# EAGLE design MD_20w (EAGLE 7.2.0)
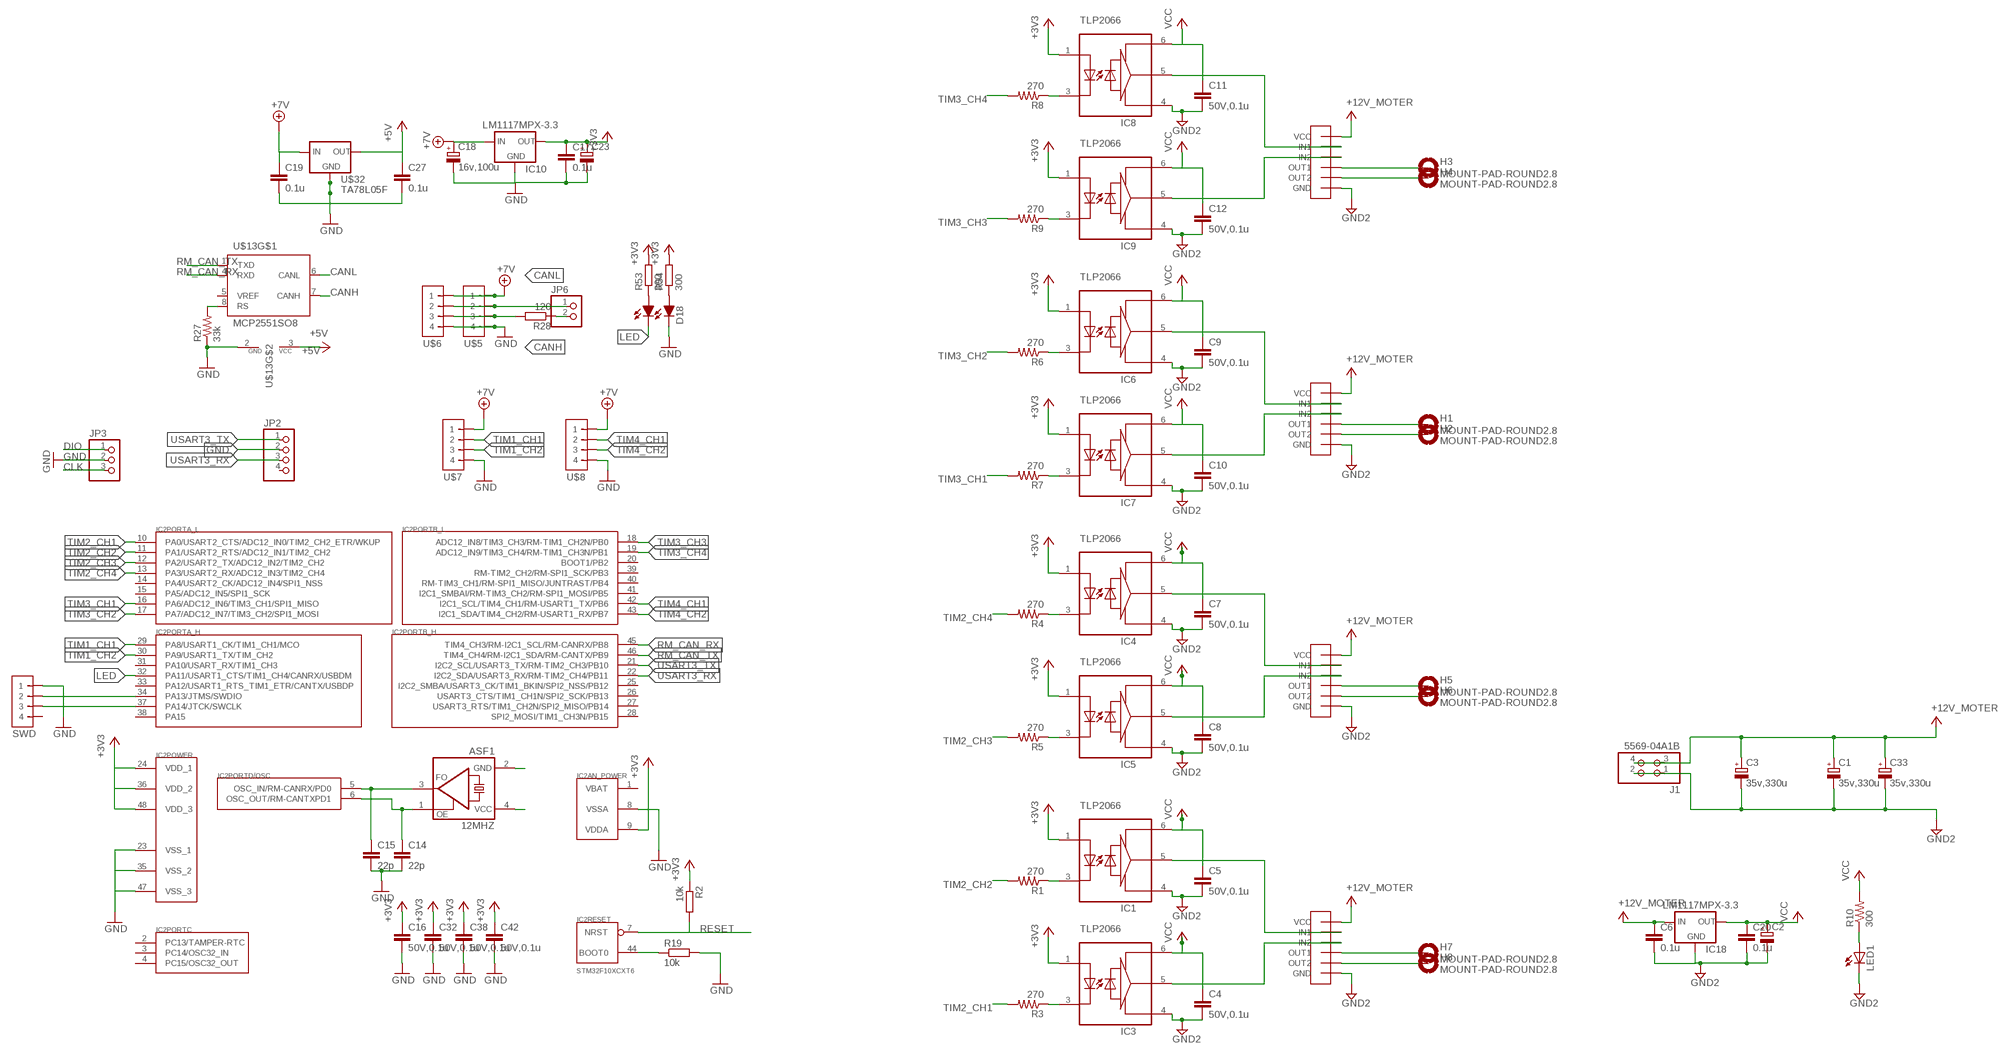
[diagram p0: schematic, sheet 1]

## Parts
12MHZ  ASF1  [ASF]
C1  35v,330u  CPOL-EU153CLV-1010  [153CLV-1010]
C2  CPOL-EU153CLV-0505  [153CLV-0505]
C3  35v,330u  CPOL-EU153CLV-1010  [153CLV-1010]
C4  50V,0.1u  C-EUC0603  [C0603]
C5  50V,0.1u  C-EUC0603  [C0603]
C6  0.1u  C-EUC0603  [C0603]
C7  50V,0.1u  C-EUC0603  [C0603]
C8  50V,0.1u  C-EUC0603  [C0603]
C9  50V,0.1u  C-EUC0603  [C0603]
C10  50V,0.1u  C-EUC0603  [C0603]
C11  50V,0.1u  C-EUC0603  [C0603]
C12  50V,0.1u  C-EUC0603  [C0603]
C14  22p  C-EUC0603  [C0603]
C15  22p  C-EUC0603  [C0603]
C16  50V,0.1u  C-EUC0603K  [C0603K]
C17  0.1u  C-EUC0603K  [C0603K]
C18  16v,100u  CPOL-EU153CLV-0605  [153CLV-0605]
C19  0.1u  C-EUC0603  [C0603]
C20  0.1u  C-EUC0603K  [C0603K]
C23  CPOL-EU153CLV-0505  [153CLV-0505]
C27  0.1u  C-EUC0603  [C0603]
C32  50V,0.1u  C-EUC0603K  [C0603K]
C33  35v,330u  CPOL-EU153CLV-1010  [153CLV-1010]
C38  50V,0.1u  C-EUC0603K  [C0603K]
C42  50V,0.1u  C-EUC0603K  [C0603K]
D18  SEC2XX4  [LED3025]
H1  MOUNT-PAD-ROUND2.8  [2,8-PAD]
H2  MOUNT-PAD-ROUND2.8  [2,8-PAD]
H3  MOUNT-PAD-ROUND2.8  [2,8-PAD]
H4  MOUNT-PAD-ROUND2.8  [2,8-PAD]
H5  MOUNT-PAD-ROUND2.8  [2,8-PAD]
H6  MOUNT-PAD-ROUND2.8  [2,8-PAD]
H7  MOUNT-PAD-ROUND2.8  [2,8-PAD]
H8  MOUNT-PAD-ROUND2.8  [2,8-PAD]
IC1  TLP2066  TLP117  [MFSOP6]
IC2  STM32F10XCXT6  [TQFP48]
IC3  TLP2066  TLP117  [MFSOP6]
IC4  TLP2066  TLP117  [MFSOP6]
IC5  TLP2066  TLP117  [MFSOP6]
IC6  TLP2066  TLP117  [MFSOP6]
IC7  TLP2066  TLP117  [MFSOP6]
IC8  TLP2066  TLP117  [MFSOP6]
IC9  TLP2066  TLP117  [MFSOP6]
IC10  LM1117MPX-3.3  LM1117  [SOT223]
IC18  LM1117MPX-3.3  LM1117  [SOT223]
J1  5569-04A1B  [5569-04A1_2]
JP2  PINHD-1X4  [1X04]
JP3  PINHD-1X3/90  [1X03/90]
JP6  PINHD-1X2  [1X02]
LED1  LEDCHIPLED_1206  [CHIPLED_1206]
R1  270  R-US_R0603  [R0603]
R2  10k  R-EU_R0603  [R0603]
R3  270  R-US_R0603  [R0603]
R4  270  R-US_R0603  [R0603]
R5  270  R-US_R0603  [R0603]
R6  270  R-US_R0603  [R0603]
R7  270  R-US_R0603  [R0603]
R8  270  R-US_R0603  [R0603]
R9  270  R-US_R0603  [R0603]
R10  300  R-US_M2012  [M2012]
R19  10k  R-EU_R0603  [R0603]
R27  33k  R-US_R0603  [R0603]
R28  120  R-EU_R0603  [R0603]
R53  300  R-EU_R0603  [R0603]
R54  300  R-EU_R0603  [R0603]
SWD  TOP_TYPE_4PIN  [TOP_TYPE_4PIN]
U$1  TB6643  [TB6643]
U$2  TB6643  [TB6643]
U$3  TB6643  [TB6643]
U$4  TB6643  [TB6643]
U$5  S4B-XH-SM4-TB  [S4B-XH-SM4-TB]
U$6  S4B-XH-SM4-TB  [S4B-XH-SM4-TB]
U$7  S4B-XH-SM4-TB  [S4B-XH-SM4-TB]
U$8  S4B-XH-SM4-TB  [S4B-XH-SM4-TB]
U$13  MCP2551SO8  [SO08]
U$32  TA78L05F  [SOT89]

## Nets
+3V3: C16.1 C17.1 C23.+ C32.1 C38.1 C42.1 IC1.1 IC2.9(AN_POWER:VDDA) IC2.24(POWER:VDD_1) IC2.36(POWER:VDD_2) IC2.48(POWER:VDD_3) IC3.1 IC4.1 IC5.1 IC6.1 IC7.1 IC8.1 IC9.1 IC10.2(OUT1) IC10.4(OUT) R2.1 R53.2 R54.2
+5V: C27.1 U$13.3(VCC) U$32.1(OUT)
+7V: C18.+ C19.1 IC10.3(IN) U$5.1 U$6.1 U$7.1 U$8.1 U$32.3(IN)
CANH: R28.2 U$5.3 U$6.3 U$13.7(CANH)
CANL: JP6.1 U$5.2 U$6.2 U$13.6(CANL)
CLK: IC2.37(PORTA_H:PA14/JTCK/SWCLK) JP3.3 SWD.3
DIO: IC2.34(PORTA_H:PA13/JTMS/SWDIO) JP3.1 SWD.2
GND: C14.2 C15.2 C16.2 C17.2 C18.- C19.2 C23.- C27.2 C32.2 C38.2 C42.2 D18.1(C0) IC2.8(AN_POWER:VSSA) IC2.23(POWER:VSS_1) IC2.35(POWER:VSS_2) IC2.47(POWER:VSS_3) IC10.1(GND) JP2.2 JP3.2 R19.2 R27.1 SWD.1 U$5.4 U$6.4 U$7.4 U$8.4 U$13.2(GND) U$32.2(GND) U$32.2@1(GND1)
GND2: C1.- C2.- C3.- C4.2 C5.2 C6.2 C7.2 C8.2 C9.2 C10.2 C11.2 C12.2 C20.2 C33.- IC1.4(GND) IC3.4(GND) IC4.4(GND) IC5.4(GND) IC6.4(GND) IC7.4(GND) IC8.4(GND) IC9.4(GND) IC18.1(GND) J1.1 J1.2 LED1.C U$1.GND U$2.GND U$3.GND U$4.GND
LED: D18.2(C1) IC2.32(PORTA_H:PA11/USART1_CTS/TIM1_CH4/CANRX/USBDM)
N$1: IC1.3 R1.1
N$2: IC3.3 R3.1
N$3: IC1.5 U$1.IN1
N$4: IC3.5 U$1.IN2
N$5: IC4.5 U$2.IN1
N$6: IC5.5 U$2.IN2
N$7: IC4.3 R4.1
N$8: IC5.3 R5.1
N$9: IC2.44(RESET:BOOT0) R19.1
N$10 [VCC]: 12MHZ.2(GND)
N$11: 12MHZ.3(FO) C15.1 IC2.5(PORTD/OSC:OSC_IN/RM-CANRX/PD0)
N$12: 12MHZ.1(OE) C14.1 IC2.6(PORTD/OSC:OSC_OUT/RM-CANTXPD1)
N$13: H5.B2,8(MOUNT) U$2.OUT1
N$14: H6.B2,8(MOUNT) U$2.OUT2
N$15: H7.B2,8(MOUNT) U$1.OUT1
N$16: IC6.3 R6.1
N$17: H8.B2,8(MOUNT) U$1.OUT2
N$18: IC7.3 R7.1
N$19: IC6.5 U$3.IN1
N$20: IC7.5 U$3.IN2
N$21: H1.B2,8(MOUNT) U$3.OUT1
N$22: H2.B2,8(MOUNT) U$3.OUT2
N$23: IC8.3 R8.1
N$24: IC9.3 R9.1
N$25: IC8.5 U$4.IN1
N$26: IC9.5 U$4.IN2
N$27: H3.B2,8(MOUNT) U$4.OUT1
N$28: H4.B2,8(MOUNT) U$4.OUT2
N$33: LED1.A R10.1
N$34: R27.2 U$13.8(RS)
N$35: JP6.2 R28.1
N$36: 12MHZ.4(VCC)
N$43: D18.3(A1) R53.1
N$58: D18.4(A0) R54.1
RESET: IC2.7(RESET:NRST) R2.2
RM_CAN_RX: IC2.45(PORTB_H:TIM4_CH3/RM-I2C1_SCL/RM-CANRX/PB8) U$13.4(RXD)
RM_CAN_TX: IC2.46(PORTB_H:TIM4_CH4/RM-I2C1_SDA/RM-CANTX/PB9) U$13.1(TXD)
TIM1_CH1: IC2.29(PORTA_H:PA8/USART1_CK/TIM1_CH1/MCO) U$7.2
TIM1_CH2: IC2.30(PORTA_H:PA9/USART1_TX/TIM_CH2) U$7.3
TIM2_CH1: IC2.10(PORTA_L:PA0/USART2_CTS/ADC12_IN0/TIM2_CH2_ETR/WKUP) R3.2
TIM2_CH2: IC2.11(PORTA_L:PA1/USART2_RTS/ADC12_IN1/TIM2_CH2) R1.2
TIM2_CH3: IC2.12(PORTA_L:PA2/USART2_TX/ADC12_IN2/TIM2_CH2) R5.2
TIM2_CH4: IC2.13(PORTA_L:PA3/USART2_RX/ADC12_IN3/TIM2_CH4) R4.2
TIM3_CH1: IC2.16(PORTA_L:PA6/ADC12_IN6/TIM3_CH1/SPI1_MISO) R7.2
TIM3_CH2: IC2.17(PORTA_L:PA7/ADC12_IN7/TIM3_CH2/SPI1_MOSI) R6.2
TIM3_CH3: IC2.18(PORTB_L:ADC12_IN8/TIM3_CH3/RM-TIM1_CH2N/PB0) R9.2
TIM3_CH4: IC2.19(PORTB_L:ADC12_IN9/TIM3_CH4/RM-TIM1_CH3N/PB1) R8.2
TIM4_CH1: IC2.42(PORTB_L:I2C1_SCL/TIM4_CH1/RM-USART1_TX/PB6) U$8.2
TIM4_CH2: IC2.43(PORTB_L:I2C1_SDA/TIM4_CH2/RM-USART1_RX/PB7) U$8.3
USART3_RX: IC2.22(PORTB_H:I2C2_SDA/USART3_RX/RM-TIM2_CH4/PB11) JP2.3
USART3_TX: IC2.21(PORTB_H:I2C2_SCL/USART3_TX/RM-TIM2_CH3/PB10) JP2.1
V+: C1.+ C3.+ C6.1 C33.+ IC18.3(IN) J1.3 J1.4 U$1.VCC U$2.VCC U$3.VCC U$4.VCC ; supply symbol labelled +12V_MOTER
VCC: C2.+ C4.1 C5.1 C7.1 C8.1 C9.1 C10.1 C11.1 C12.1 C20.1 IC1.6(VCC) IC3.6(VCC) IC4.6(VCC) IC5.6(VCC) IC6.6(VCC) IC7.6(VCC) IC8.6(VCC) IC9.6(VCC) IC18.2(OUT1) IC18.4(OUT) R10.2
Unconnected: IC2.2(PORTC:PC13/TAMPER-RTC) IC2.3(PORTC:PC14/OSC32_IN) IC2.4(PORTC:PC15/OSC32_OUT) IC2.14(PORTA_L:PA4/USART2_CK/ADC12_IN4/SPI1_NSS) IC2.15(PORTA_L:PA5/ADC12_IN5/SPI1_SCK) IC2.20(PORTB_L:BOOT1/PB2) IC2.25(PORTB_H:I2C2_SMBA/USART3_CK/TIM1_BKIN/SPI2_NSS/PB12) IC2.26(PORTB_H:USART3_CTS/TIM1_CH1N/SPI2_SCK/PB13) IC2.27(PORTB_H:USART3_RTS/TIM1_CH2N/SPI2_MISO/PB14) IC2.28(PORTB_H:SPI2_MOSI/TIM1_CH3N/PB15) IC2.31(PORTA_H:PA10/USART_RX/TIM1_CH3) IC2.33(PORTA_H:PA12/USART1_RTS_TIM1_ETR/CANTX/USBDP) IC2.38(PORTA_H:PA15) IC2.39(PORTB_L:RM-TIM2_CH2/RM-SPI1_SCK/PB3) IC2.40(PORTB_L:RM-TIM3_CH1/RM-SPI1_MISO/JUNTRAST/PB4) IC2.41(PORTB_L:I2C1_SMBAI/RM-TIM3_CH2/RM-SPI1_MOSI/PB5) JP2.4 SWD.4 U$13.5(VREF)

## Notes on the sheet
- TLP2066
- TLP2066
- TLP2066
- TLP2066
- TLP2066
- TLP2066
- TLP2066
- TLP2066

## Power pins joined to a net without a drawn wire
VBAT: IC2.1(AN_POWER:VBAT)

## Library data of the parts
12MHZ = crystal:ASF*: CRYSTAL CLOCK OSCILLATORS 5.0 Vdc or 3.3 Vdc - LOW PROFILE ULTRA MINIATURE CERAMIC SURFACE MOUNT Source: http://www.abracon.com/Oscillators/asf1-L-L1.pdf
C1-C3 C18 C23 C33 = rcl:CPOL-EU: POLARIZED CAPACITOR, European symbol
C4-C12 C14 C15 C19 C27 = rcl:C-EU: CAPACITOR, European symbol
C16 C17 C20 C32 C38 C42 = resistor:C-EU: CAPACITOR, European symbol
D18 = SRT162-010:SEC2XX4
H1-H8 = holes:MOUNT-PAD-ROUND: MOUNTING PAD, round
IC1 IC3-IC9 = PhotoCoupler:TLP117
IC2 = stm32:STM32F10XCXT6: ST STM32F101/103 48pin LQFP
IC10 IC18 = VoltageRegulator:LM1117
J1 = Molex:5569-04A1
JP2 = pinhead:PINHD-1X4: PIN HEADER
JP3 = pinhead:PINHD-1X3: PIN HEADER
JP6 = pinhead:PINHD-1X2: PIN HEADER
LED1 = led:LED: LED OSRAM: - CHIPLED LG R971, LG N971, LY N971, LG Q971, LY Q971, LO R971, LY R971 LH N974, LH R974 LS Q976, LO Q976, LY Q976 LO Q996 - Hyper CHIPLED LW Q18S LB Q993, LB Q99A, LB R99A - SideLED LS A670, LO A670, LY A670, LG A670, LP A670 LB A673, LV A673, LT A673, LW A673 LH A674 LY A675 LS A676, LA A676, LO A676, LY A676, LW A676 LS A679, LY A679, LG A679 - Hyper Micro SIDELED® LS Y876, LA Y876, LO Y876, LY Y876 LT Y87S - SmartLED LW L88C, LW L88S LB L89C, LB L89S, LG L890 LS L89K, LO L89K, LY L89K LS L896, LA L896, LO L896, LY L896 - TOPLED LS T670, LO T670, LY T670, LG T670, LP T670 LSG T670, LSP T670, LSY T670, LOP T670, LYG T670 LG T671, LOG T671, LSG T671 LB T673, LV T673, LT T673, LW T673 LH T674 LS T676, LA T676, LO T676, LY T676, LB T676, LH T676, LSB T676, LW T676 LB T67C, LV T67C, LT T67C, LS T67K, LO T67K, LY T67K, LW E67C LS E67B, LA E67B, LO E67B, LY E67B, LB E67C, LV E67C, LT E67C LW T67C LS T679, LY T679, LG T679 LS T770, LO T770, LY T770, LG T770, LP T770 LB T773, LV T773, LT T773, LW T773 LH T774 LS E675, LA E675, LY E675, LS T675 LS T776, LA T776, LO T776, LY T776, LB T776 LHGB T686 LT T68C, LB T68C - Hyper Mini TOPLED® LB M676 - Mini TOPLED Santana® LG M470 LS M47K, LO M47K, LY M47K Source: http://www.osram.convergy.de LUXEON: - LUMILED® LXK2-PW12-R00, LXK2-PW12-S00, LXK2-PW14-U00, LXK2-PW14-V00 LXK2-PM12-R00, LXK2-PM12-S00, LXK2-PM14-U00 LXK2-PE12-Q00, LXK2-PE12-R00, LXK2-PE12-S00, LXK2-PE14-T00, LXK2-PE14-U00 LXK2-PB12-K00, LXK2-PB12-L00, LXK2-PB12-M00, LXK2-PB14-N00, LXK2-PB14-P00, LXK2-PB14-Q00 LXK2-PR12-L00, LXK2-PR12-M00, LXK2-PR14-Q00, LXK2-PR14-R00 LXK2-PD12-Q00, LXK2-PD12-R00, LXK2-PD12-S00 LXK2-PH12-R00, LXK2-PH12-S00 LXK2-PL12-P00, LXK2-PL12-Q00, LXK2-PL12-R00 Source: www.luxeon.com KINGBRIGHT: KA-3528ASYC Source: www.kingbright.com
R1 R3-R9 R27 = resistor:R-US_: RESISTOR, American symbol
R2 R19 = rcl:R-EU_: RESISTOR, European symbol
R10 = rcl:R-US_: RESISTOR, American symbol
R28 R53 R54 = resistor:R-EU_: RESISTOR, European symbol
SWD = GHconnector:TOP_TYPE_4PIN
U$1-U$4 = tb6643:TB6643
U$5-U$8 = S4B-XH-SM4-TB:S4B-XH-SM4-TB
U$13 = can:MCP2551: CAN Tranceiver Microchip
U$32 = v-reg:TA78L05F

## Board
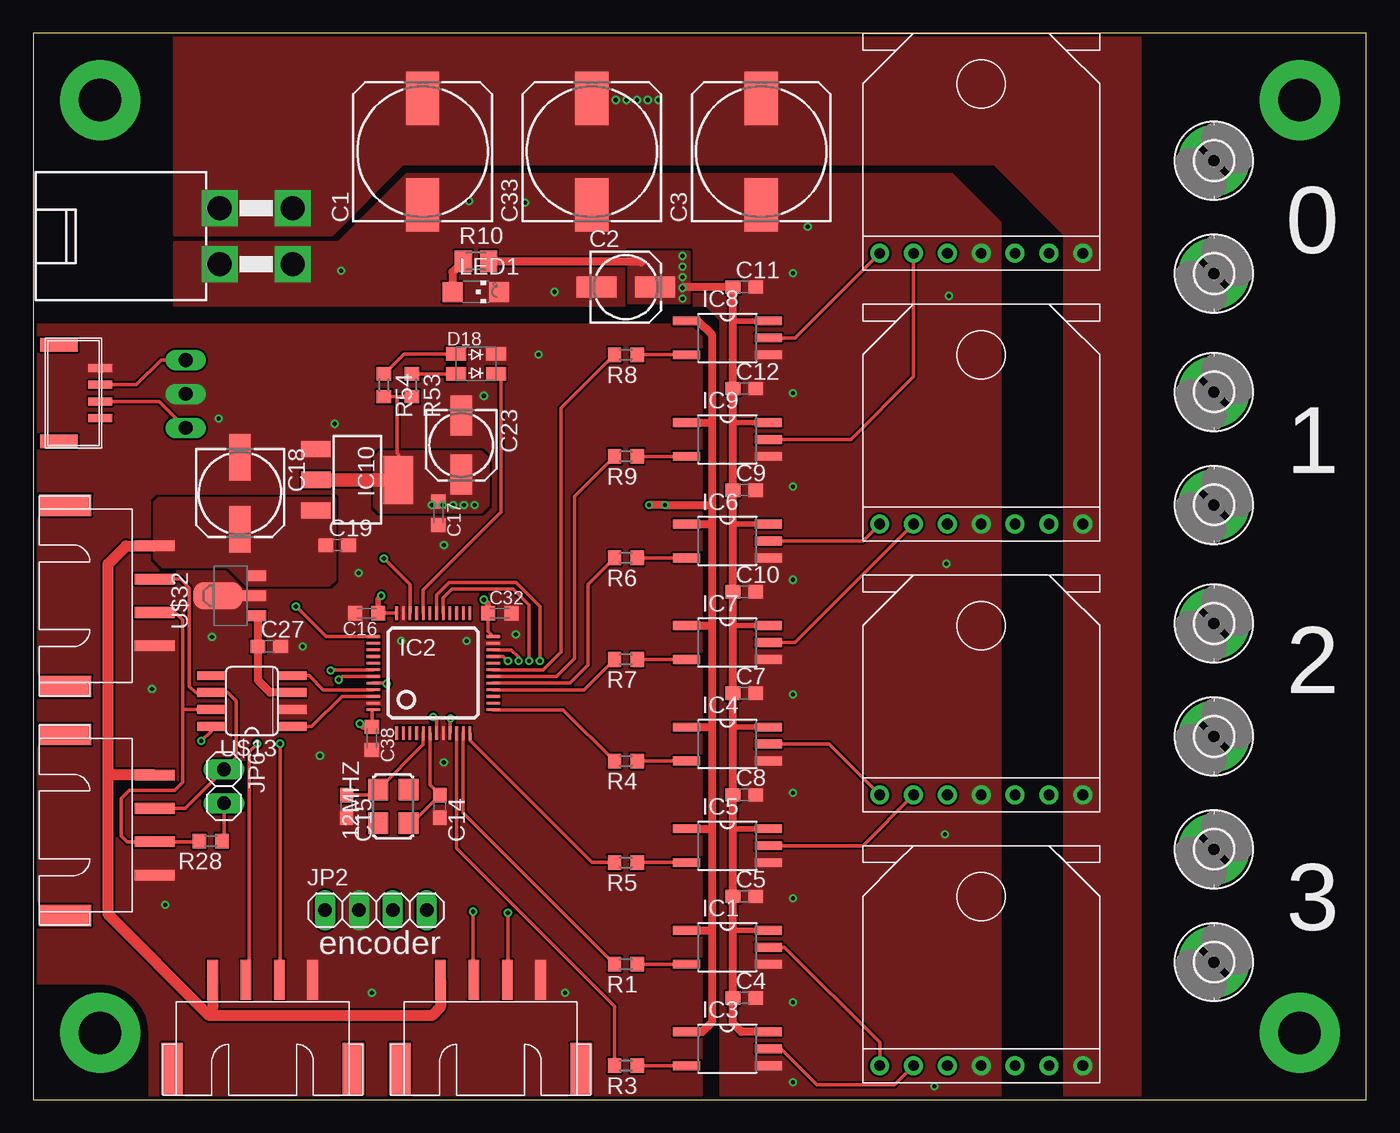
[diagram p1: board, top side]
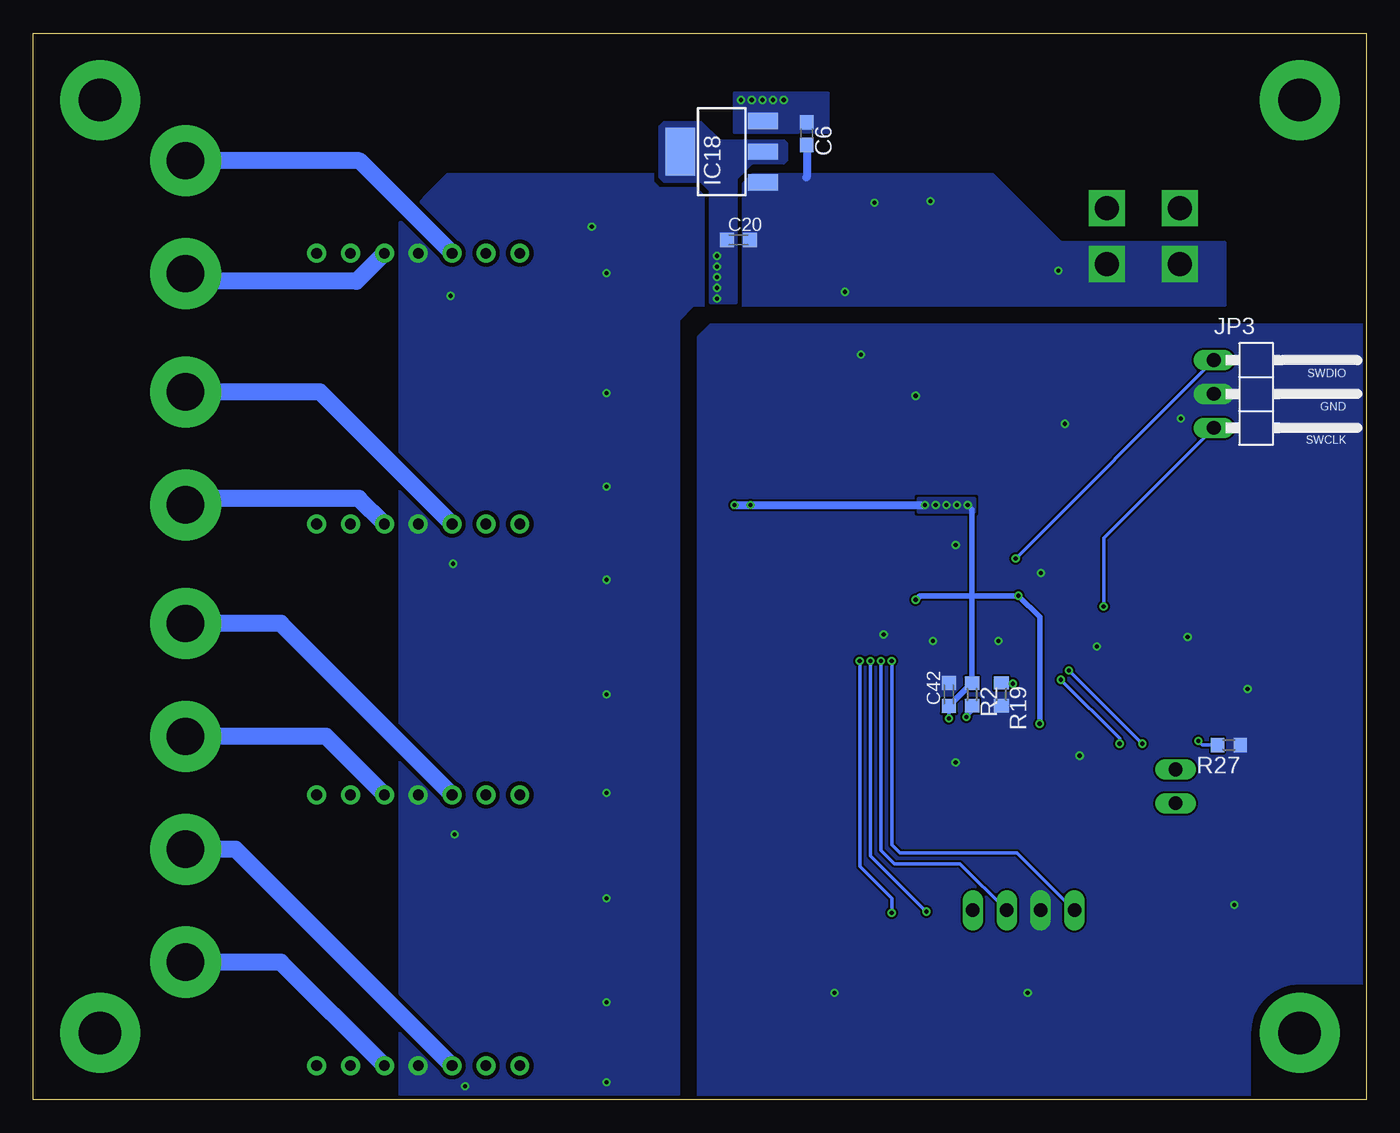
[diagram p2: board, bottom side, seen from below]

Size 100 x 80 mm. Coordinates in mm from the lower left corner, seen from the top.
Outline: 0,0 100,0 100,80 0,80 0,0
Copper layers (1*16): Top 0.035mm / dielectric 1.5mm / Bottom 0.035mm
Design rules "default *": minimum track width 6mil, minimum drill 12mil, track to track 6mil, track to pad 6mil, pad to pad 6mil, via to via 6mil, smd to smd 0mil, copper to edge 10mil, drill to drill 10mil, minimum pad ring 10mil, minimum via ring 6mil, stop-mask expansion 2mil, vias tented up to drill 100mil, thermal gap 10mil
tRestrict: 12 lines
bRestrict: 12 lines

### Footprints (pad centres in the part's own frame; a part is rotated, then mirrored left to right if it is on the bottom)
ASF = smd 1.6 x 1.5: 1 -1.25,-1.15; 2 1.25,-1.15; 3 1.25,1.15; 4 -1.25,1.15
153CLV-1010 = smd 4 x 2.5: + 4,0; - -4,0
153CLV-0505 = smd 3 x 1.6: + 2.2,0; - -2.2,0
C0603 = smd 1.1 x 1: 1 -0.85,0; 2 0.85,0
C0603K = smd 1.05 x 1.08: 1 -0.875,0; 2 0.875,0
153CLV-0605 = smd 3.5 x 1.6: + 2.7,0; - -2.7,0
LED3025 = smd 1.5 x 1: 1 1.5,0.75; 2 1.5,-0.75; 3 -1.5,-0.75; 4 -1.5,0.75
2,8-PAD = drill 2.8 pad 5.334: B2,8 0,0
MFSOP6 = smd 0.66 x 2.032: 1 -1.27,-3.073; 3 1.27,-3.073; 4 1.27,3.073; 5 0,3.073; 6 -1.27,3.073
TQFP48 = smd 0.2 x 1: 1 -2.75,-4.5; 2 -2.25,-4.5; 3 -1.75,-4.5; 4 -1.25,-4.5; 5 -0.75,-4.5; 6 -0.25,-4.5; 7 0.25,-4.5; 8 0.75,-4.5; 9 1.25,-4.5; 10 1.75,-4.5; 11 2.25,-4.5; 12 2.75,-4.5; 25 2.75,4.5; 26 2.25,4.5; 27 1.75,4.5; 28 1.25,4.5; 29 0.75,4.5; 30 0.25,4.5; 31 -0.25,4.5; 32 -0.75,4.5; 33 -1.25,4.5; 34 -1.75,4.5; 35 -2.25,4.5; 36 -2.75,4.5 | smd 1 x 0.2: 13 4.5,-2.75; 14 4.5,-2.25; 15 4.5,-1.75; 16 4.5,-1.25; 17 4.5,-0.75; 18 4.5,-0.25; 19 4.5,0.25; 20 4.5,0.75; 21 4.5,1.25; 22 4.5,1.75; 23 4.5,2.25; 24 4.5,2.75; 37 -4.5,2.75; 38 -4.5,2.25; 39 -4.5,1.75; 40 -4.5,1.25; 41 -4.5,0.75; 42 -4.5,0.25; 43 -4.5,-0.25; 44 -4.5,-0.75; 45 -4.5,-1.25; 46 -4.5,-1.75; 47 -4.5,-2.25; 48 -4.5,-2.75
SOT223 = smd 1.219 x 2.235: 1 -2.311,-3.099; 2 0,-3.099; 3 2.311,-3.099 | smd 3.6 x 2.2: 4 0,3.099
5569-04A1_2 = drill 1.8 square: 1 2.1,0; 2 2.1,5.5; 3 -2.1,0; 4 -2.1,5.5
1X04 = drill 1.016 long: 1 -3.81,0; 2 -1.27,0; 3 1.27,0; 4 3.81,0
1X03/90 = drill 1.016 long: 1 -2.54,-3.81; 2 0,-3.81; 3 2.54,-3.81
1X02 = drill 1.016 long: 1 -1.27,0; 2 1.27,0
CHIPLED_1206 = smd 1.5 x 1.5: A 0,-1.75; C 0,1.75
R0603 = smd 1 x 1.1: 1 -0.85,0; 2 0.85,0
M2012 = smd 1.3 x 1.6: 1 -0.95,0; 2 0.95,0
TOP_TYPE_4PIN = smd 0.6 x 1.8: 1 -1.875,2.025; 2 -0.625,2.025; 3 0.625,2.025; 4 1.875,2.025 | smd 1 x 2.8: P$1 -3.625,-1.075; P$2 3.625,-1.075
TB6643 = drill 0.8 pad 1.422: GND 0,0; IN1 -7.62,0; IN2 -5.08,0; OUT1 -2.54,0; OUT2 2.54,0; P$3 5.08,0; VCC 7.62,0
S4B-XH-SM4-TB = smd 0.8 x 3: 1 -3.75,7.4; 2 -1.25,7.4; 3 1.25,7.4; 4 3.75,7.4 | smd 1.6 x 3.9: P$1 -6.8,0.7; P$2 6.8,0.7
SO08 = smd 0.66 x 2.032: 1 -1.905,-3.073; 2 -0.635,-3.073; 3 0.635,-3.073; 4 1.905,-3.073; 5 1.905,3.073; 6 0.635,3.073; 7 -0.635,3.073; 8 -1.905,3.073
SOT89 = smd 0.8 x 1.4: 1 -1.499,-1.981; 3 1.499,-1.981 | smd 0.8 x 1.9: 2 0,-1.727 | smd 2.032 x 3.65: 2@1 0,0.94

### Placement (x,y rotation side)
12MHZ  27,22 90 top
C1  29.21,71.12 90 top
C2  44.45,60.96 0 top
C3  54.61,71.12 90 top
C4  53.34,7.62 0 top
C5  53.34,15.24 0 top
C6  41.97,72.47 270 bottom
C7  53.34,30.48 0 top
C8  53.34,22.86 0 top
C9  53.34,45.72 0 top
C10  53.34,38.1 0 top
C11  53.34,60.96 0 top
C12  53.34,53.34 0 top
C14  30.5,22 270 top
C15  23.5,22 270 top
C16  25,36.5 180 top
C17  30.4,44 270 top
C18  15.5,45.5 270 top
C19  22.8,41.6 0 top
C20  47.09,64.51 0 bottom
C23  32.1,49.1 270 top
C27  17.7,34 0 top
C32  35,36.5 0 top
C33  41.91,71.12 90 top
C38  25.41,27.09 270 top
C42  31.31,30.39 90 bottom
D18  33.2,55.2 0 top
H1  88.58,53.09 0 top
H2  88.58,44.62 0 top
H3  88.58,70.44 0 top
H4  88.58,61.97 0 top
H5  88.58,35.72 0 top
H6  88.58,27.25 0 top
H7  88.58,18.78 0 top
H8  88.58,10.31 0 top
IC1  52.07,11.43 270 top
IC2  30,32 0 top
IC3  52.07,3.81 270 top
IC4  52.07,26.67 270 top
IC5  52.07,19.05 270 top
IC6  52.07,41.91 270 top
IC7  52.07,34.29 270 top
IC8  52.07,57.15 270 top
IC9  52.07,49.53 270 top
IC10  24.3,46.5 270 top
IC18  48.36,71.12 90 bottom
J1  13.97,64.77 270 top
JP2  25.7,14.2 0 top
JP3  7.62,52.94 270 bottom
JP6  14.3,23.5 270 top
LED1  33.2,60.6 270 top
R1  44.45,10.16 180 top
R2  29.57,30.39 270 bottom
R3  44.45,2.54 180 top
R4  44.45,25.4 180 top
R5  44.45,17.78 180 top
R6  44.45,40.64 180 top
R7  44.45,33.02 180 top
R8  44.45,55.88 180 top
R9  44.45,48.26 180 top
R10  33.2,62.9 0 top
R19  27.37,30.41 270 bottom
R27  10.3,26.6 180 bottom
R28  13.3,19.4 180 top
R53  28.4,53.6 270 top
R54  26.3,53.6 270 top
SWD  3.01,53.01 270 top
U$1  71.12,2.54 0 top
U$2  71.12,22.86 0 top
U$3  71.12,43.18 0 top
U$4  71.12,63.5 0 top
U$5  1.7,20.6 270 top
U$6  1.7,37.8 270 top
U$7  34.3,1.6 0 top
U$8  17.2,1.6 0 top
U$13  16.4,29.9 90 top
U$32  14.8,37.8 90 top

### Tracks (layer width: path | path; a pad name or v marks a point on that pad's centre or on a via)
+3V3  (via drill 0.3)
  Top 0.254: C16.1 IC2.36 | IC2.48 25.41,29.16 C38.1 | IC2.9 31.25,28.55 v31.3,28.6 | IC2.24 34.12,35.12 C32.1 | 27.3,52.75 27.3,48.5 27.4,48.4 | R54.2 27.3,52.75 | 27.3,52.75 R53.2
  Top 0.406: C16.1 25.88,37.58 v26.1,37.8 | C38.1 24.73,27.96 v24.5,28.2 | C32.1 34.12,37.17 v33.8,37.5
  Top 0.61: 50.9,50.8 50.9,57.4 49.88,58.42 IC8.1 | 50.9,50.8 50.9,44.7 | 50.9,44.7 50.9,43.2 | 50.9,43.2 50.9,35.5 | 50.9,35.5 50.9,28 | 50.9,28 50.9,20.3 | 50.9,20.3 50.9,12.6 | 50.9,12.6 50.9,5.8 50.18,5.08 IC3.1 | 50.9,44.7 50.8,44.6 v47.4,44.6 v46.2,44.6 | IC9.1 50.9,50.8 | IC6.1 50.88,43.18 50.9,43.2 | IC7.1 50.84,35.56 50.9,35.5 | IC4.1 50.84,27.94 50.9,28 | IC5.1 50.88,20.32 50.9,20.3 | IC1.1 50.8,12.7 50.9,12.6
  Top 1.016: IC10.2 IC10.4
  Bottom 0.254: v31.3,28.6 v31.31,28.61 C42.1
  Bottom 0.406: C42.1 31.3,29.52 R2.1 29.57,37.8 | 29.57,37.8 29.57,44.27 v29.9,44.6 | 29.57,37.8 v26.1,37.8 24.5,36.2 v24.5,28.2 | v33.8,37.5 33.5,37.8 29.57,37.8
  Bottom 0.61: v47.4,44.6 v33.1,44.6
  other vias: 30.7,44.6 31.5,44.6 32.3,44.6
  pour Top (no thermals): 26,48.6 33.6,48.6 34.1,48.1 34.1,44.6 33.6,44.1 26,44.1 25.6,44.5 25.6,48.2
  pour Bottom: 29.4,44.1 29.4,45.1 33.6,45.1 33.6,44.1
+5V
  Top 0.61: U$13.3 17.77,30.54 16.85,31.45 C27.1 16.85,36.23 U$32.1
+7V
  Top 0.813: 5.6,24.4 5.6,13.9 13.05,6.45 | 5.6,24.4 5.6,40.2 6.95,41.55 U$6.1 | U$7.1 30.55,6.95 29.9,6.3 13.2,6.3 13.05,6.45 | U$5.1 5.65,24.35 5.6,24.4 | U$8.1 13.45,6.85 13.05,6.45
  pour Top (no thermals): 9.4,45.1 22.6,45.1 22.6,39 22.2,38.6 16,38.6 14.6,40 9.7,40 9.1,40.6 9.1,44.8
CANH
  Top 0.254: R28.2 12.4,19.35 U$5.3 7.05,19.35 6.6,19.8 6.6,22.6 7.2,23.2 10.6,23.2 11.2,23.8 11.2,29.3 | 11.2,29.3 11.2,36 10.65,36.55 U$6.3 | U$13.7 11.23,29.27 11.2,29.3
CANL
  Top 0.254: U$6.2 11.05,39.05 11.7,38.4 11.7,31 12.16,30.54 U$13.6 14.56,30.54 15.2,29.9 15.2,25.67 JP6.1 11.38,21.85 U$5.2
CLK  (via drill 0.3)
  Top 0.254: IC2.37 21.95,34.75 v19.7,37 | SWD.3 9.45,52.38 JP3.3
  Bottom 0.254: v19.7,37 19.7,42.13 JP3.3
DIO  (via drill 0.3)
  Top 0.254: v26.3,40.6 28.25,38.65 IC2.34 | SWD.2 7.74,53.63 9.58,55.48 JP3.1
  Bottom 0.254: JP3.1 v26.3,40.61 v26.3,40.6
GND  (via drill 0.3)
  other vias: 13.9,51.1 22.6,50.7 37.9,55.9 33.8,52.8 8.9,30.8 13.4,34.7 20.2,34 24.4,39.5 9.9,14.6 25.4,8 39.9,8 21.5,25.8 36.2,34.9 32.5,34.4 27.6,34.4 30.8,25.3 30.8,41.6
  pour Top (rank 6, no thermals): -4.2,58.1 49.2,58.1 50.1,57.2 50.1,-6.8 -4.2,-6.8
  pour Bottom (rank 6, no thermals): -2.5,58.1 49.2,58.1 50.1,57.2 50.1,-6.3 -2.5,-6.3
GND2  (via drill 0.3, 0.3 pad 0.25)
  Bottom 0.61: C6.2 41.97,69.23 42,69.2
  other vias: 23.1,62.2 32.7,67.4 36.9,67.3 58.1,65.5 39.1,60.6 57,62 57,53 57,46 57,39 57,30.4 57,23 57,15.1 57,7.3 57,1.3 67.6,1 68.4,19.9 68.5,40.2 68.7,60.3
  pour Top (rank 6, no thermals): 10.6,64.3 22.9,64.3 28,69.4 68.9,69.4 72.5,65.8 72.5,-11.8 53.7,-11.8 51.6,-11.8 51.6,55.6 51.6,58.5 50.5,59.6 10.6,59.6
  pour Bottom (isolate 0.305, rank 6, no thermals): 10.6,64.3 22.9,64.3 28,69.4 68.9,69.4 72.5,65.8 72.5,-13 51.7,-13 51.6,-13 51.6,58.5 50.5,59.6 10.6,59.6
LED
  Top 0.254: IC2.32 29.25,38.25 35.1,44.1 35.1,54.05 D18.2
N$1
  Top 0.254: R1.1 IC1.3
N$2
  Top 0.254: R3.1 IC3.3
N$3
  Top 0.254: IC1.5 56.37,11.43 63.5,4.3 U$1.IN1
N$4
  Top 0.254: U$1.IN2 64.6,1.1 58.8,1.1 56.09,3.81 IC3.5
N$5
  Top 0.254: IC4.5 59.69,26.67 U$2.IN1
N$6
  Top 0.254: IC5.5 62.23,19.05 U$2.IN2
N$7
  Top 0.254: R4.1 IC4.3
N$8
  Top 0.254: R5.1 IC5.3
N$9  (via drill 0.3)
  Top 0.254: IC2.44 26.45,31.25 v26.5,31.2
  Bottom 0.254: v26.5,31.2 27.31,31.2 R19.1
N$11
  Top 0.254: C15.1 25.45,22.85 12MHZ.3 29.25,26.65 IC2.5
N$12
  Top 0.254: IC2.6 29.75,23.6 C14.1 28.4,20.75 12MHZ.1
N$13
  Bottom 1.27: U$2.OUT1 81.44,35.72 H5.B2,8
N$14
  Bottom 1.27: U$2.OUT2 78.05,27.25 H6.B2,8
N$15
  Bottom 1.27: U$1.OUT1 84.82,18.78 H7.B2,8
N$16
  Top 0.254: R6.1 IC6.3
N$17
  Bottom 1.27: U$1.OUT2 81.43,10.31 H8.B2,8
N$18
  Top 0.254: R7.1 IC7.3
N$19
  Top 0.254: IC6.5 62.23,41.91 U$3.IN1
N$20
  Top 0.254: IC7.5 57.15,34.29 U$3.IN2
N$21
  Bottom 1.27: U$3.OUT1 78.49,53.09 H1.B2,8
N$22
  Bottom 1.27: U$3.OUT2 75.58,45.1 88.1,45.1 H2.B2,8
N$23
  Top 0.254: R8.1 IC8.3
N$24
  Top 0.254: R9.1 IC9.3
N$25
  Top 0.254: U$4.IN1 57.15,57.15 IC8.5
N$26
  Top 0.254: U$4.IN2 66.04,54.24 61.33,49.53 IC9.5
N$27
  Bottom 1.27: U$4.OUT1 75.52,70.44 H3.B2,8
N$28
  Bottom 1.27: U$4.OUT2 75.76,61.4 88.01,61.4 H4.B2,8
N$29  (via drill 3.2 pad 6)
  other vias: 5,5
N$30  (via drill 3.2 pad 6)
  other vias: 95,5
N$31  (via drill 3.2 pad 6)
  other vias: 95,75
N$32  (via drill 3.2 pad 6)
  other vias: 5,75
N$33
  Top 0.61: R10.1 31.45,62.1 LED1.A
N$34  (via drill 0.3)
  Top 0.254: v12.6,26.9 13.33,27.63 U$13.8
  Bottom 0.254: R27.2 12.3,26.6 v12.6,26.9
N$35
  Top 0.254: JP6.2 14.3,19.55 R28.1
N$43
  Top 0.254: R53.1 D18.3
N$58
  Top 0.254: R54.1 27.8,55.95 D18.4
RESET  (via drill 0.3)
  Top 0.254: IC2.7 30.25,28.45 v30,28.7
  Bottom 0.254: v30,28.7 29.57,29.13 R2.2
RM_CAN_RX
  Top 0.254: IC2.45 21.75,30.75 20.7,31.8 U$13.4
RM_CAN_TX
  Top 0.254: IC2.46 23.15,30.25 20.89,28 U$13.1
TIM1_CH1  (via drill 0.3)
  Top 0.254: IC2.29 30.75,37.65 31.4,38.3 36,38.3 37.2,37.1 v37.2,32.9 | v33,14.1 33,9.05 U$7.2
  Bottom 0.254: v37.2,32.9 37.2,18.3 v33,14.1
TIM1_CH2  (via drill 0.3)
  Top 0.254: IC2.30 30.25,37.85 31.2,38.8 36.2,38.8 38,37 v38,32.9 | v35.6,14 35.6,9.05 U$7.3
  Bottom 0.254: v38,32.9 38,17.5 35.6,15.1 v35.6,14
TIM2_CH1
  Top 0.254: IC2.10 31.75,18.85 43.6,7 R3.2
TIM2_CH2
  Top 0.254: IC2.11 32.25,21.51 R1.2
TIM2_CH3
  Top 0.254: IC2.12 32.75,26.95 41.92,17.78 R5.2
TIM2_CH4
  Top 0.254: IC2.13 39.75,29.25 R4.2
TIM3_CH1
  Top 0.254: IC2.16 41.33,30.75 R7.2
TIM3_CH2
  Top 0.254: IC2.17 40.25,31.25 41.6,32.6 41.6,38.64 R6.2
TIM3_CH3
  Top 0.254: IC2.18 39.25,31.75 40.6,33.1 40.6,45.26 R9.2
TIM3_CH4
  Top 0.254: IC2.19 38.25,32.25 39.6,33.6 39.6,51.88 R8.2
TIM4_CH1  (via drill 0.3)
  Top 0.254: IC2.42 22.35,32.25 v22.3,32.2 | v16.8,26.7 16.2,26.1 16.2,10 15.95,9.75 U$8.2
  Bottom 0.254: v22.3,32.2 v16.8,26.7
TIM4_CH2  (via drill 0.3)
  Top 0.254: IC2.43 23.15,31.75 v22.9,31.5 | v18.5,26.7 18.5,9.05 U$8.3
  Bottom 0.254: v22.9,31.5 18.5,27.1 v18.5,26.7
USART3_RX  (via drill 0.3)
  Top 0.254: IC2.22 35.85,33.75 36.4,33.2 v36.4,32.9
  Bottom 0.254: v36.4,32.9 36.4,18.7 35.4,17.7 30.47,17.7 JP2.3
USART3_TX  (via drill 0.3)
  Top 0.254: IC2.21 35.25,33.25 v35.6,32.9
  Bottom 0.254: JP2.1 26.19,18.5 35,18.5 35.6,19.1 v35.6,32.9
V+  (via drill 0.3)
  other vias: 44.5,75 45.3,75 46.1,75 46.9,75 43.7,75
  pour Top (no thermals): 10.6,82 83,82 83,-4.8 77.4,-4.8 77.4,64.9 72.1,70.2 27.7,70.2 22.4,64.9 10.6,64.9
  pour Bottom (isolate 0.305, no thermals): 40.4,75.5 47.4,75.5 47.4,72.6 40.4,72.6
VCC  (via drill 0.3)
  Top 0.406: IC8.6 52.57,58.42 52.49,58.5 | IC9.6 52.59,50.8 52.49,50.9 | IC6.6 52.61,43.18 52.49,43.3 | IC7.6 52.63,35.56 52.49,35.7 | IC4.6 52.55,27.94 52.49,28 | IC5.6 52.61,20.32 52.49,20.2 | IC1.6 52.59,12.7 52.49,12.8
  Top 0.61: v48.7,60.9 48.76,60.96 C11.1 52.49,58.5 C12.1 52.49,50.9 C9.1 52.49,43.3 C10.1 52.49,35.7 C7.1 52.49,28 C8.1 52.49,20.2 C5.1 52.49,12.8 C4.1 52.49,5.71 53.12,5.08 IC3.6 | R10.2 45.5,62.9 45.6,62.8
  other vias: 48.7,63.3 48.7,62.5 48.7,61.7 48.7,60.1
  pour Bottom (no thermals): 43.7,71.9 48.5,71.9 49.9,73.3 52.7,73.3 53,73 53,69.2 52.7,68.9 49.9,68.9 49.2,68.2 49.2,59.8 47.3,59.8 47.3,69.1 46.1,70.3 43.7,70.3 43.5,70.5 43.5,71.7
  pour Top (no thermals): 44.7,63.6 49.2,63.6 49.2,59.8 44.7,59.8

### Text on the board
tNames: 0 | 1 | 2 | 3 | encoder
bNames: SWDIO | GND | SWCLK